# Altium schematic sheet LED+Transistor.SchDoc
size A4
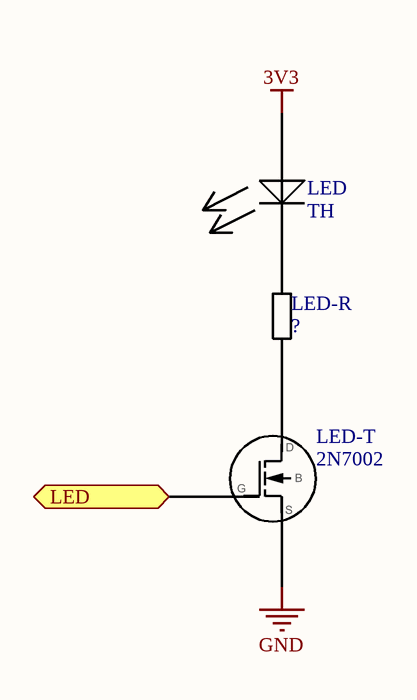
[diagram p0: LED+Transistor.SchDoc]

## Parts
LED  TH  [LED 3mm]
LED-R  ?  [R 0805 / 2012]
LED-T  2N7002  [SOT-23-3]

## Ports
LED (in)

## Nets
3V3: LED.1(+)
GND: LED-T.2
LED: LED-T.1 ; port LED
NetLED-R_1: LED-R.1 LED-T.3
NetLED_2: LED.2(-) LED-R.2

## Library data of the parts
LED = LED
LED-R = Resistor
LED-T = 2N7002: N-FET